# Altium schematic sheet EVK-IRIS-W1_MikroBuses.SchDoc: Top Level Design
size A3; CompanyName: Rigado, LLC; Organization: Rigado; DocumentNumber: 10; SheetNumber: 10; SheetTotal: 14; Website: www.rigado.com; SheetSize: B
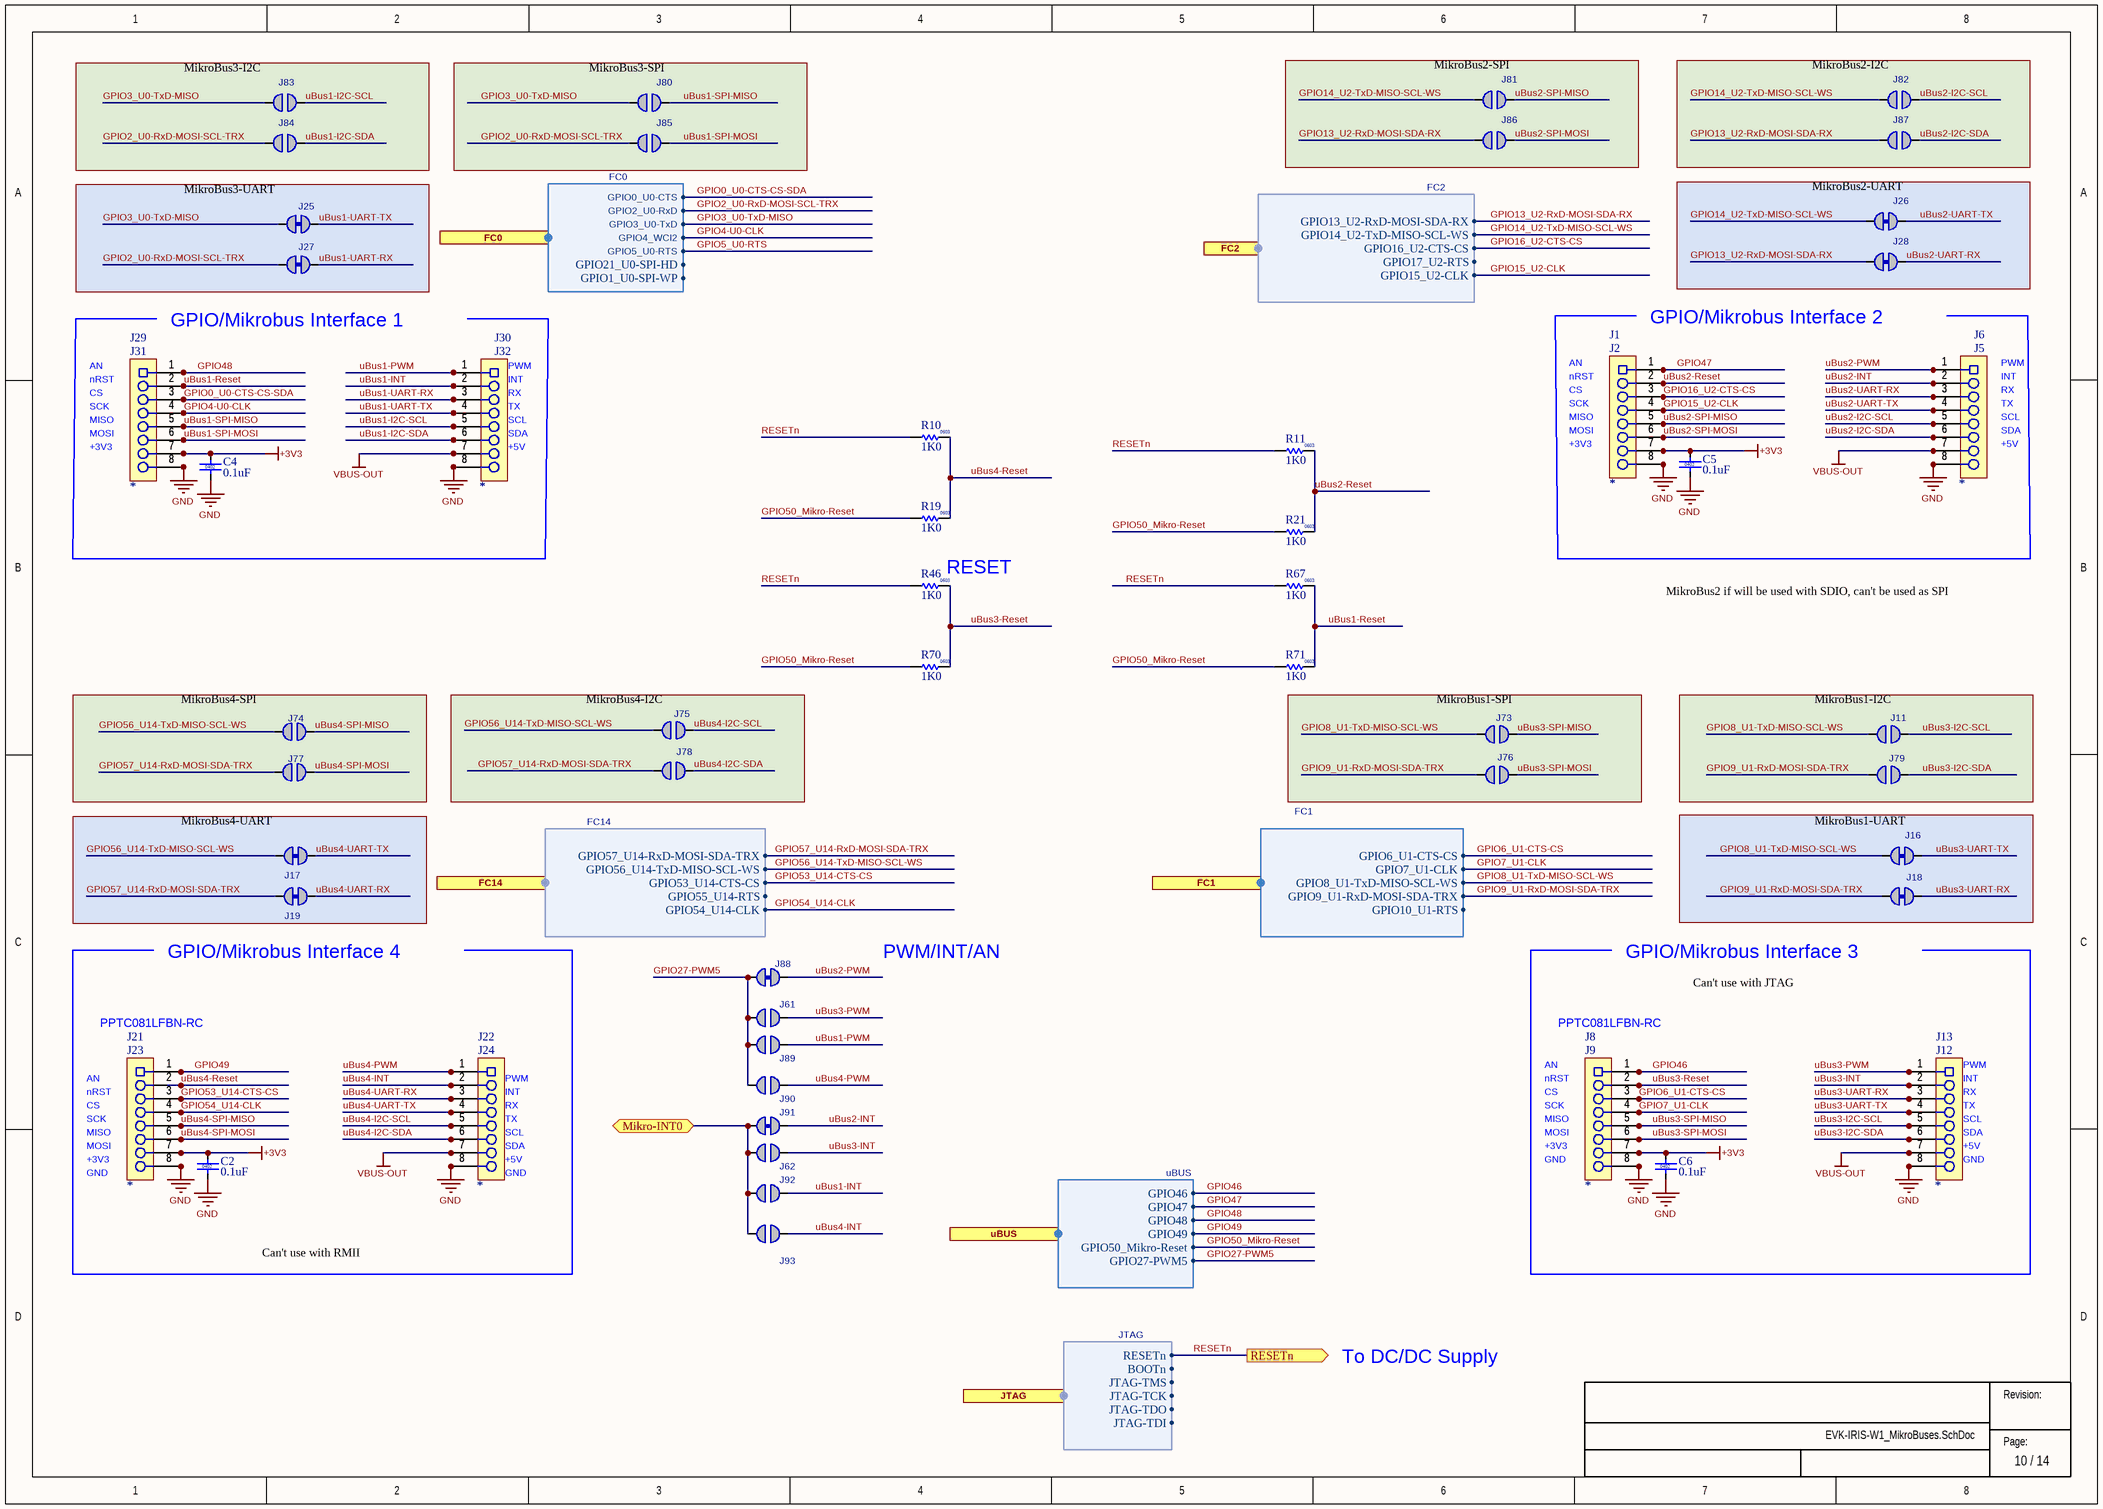
[diagram p0: EVK-IRIS-W1_MikroBuses.SchDoc]

## Parts
C2  value 0.1uF  Size: 0402  [Cap 0402 HD]
C4  value 0.1uF  Size: 0402  [Cap 0402 HD]
C5  value 0.1uF  Size: 0402  [Cap 0402 HD]
C6  value 0.1uF  Size: 0402  [Cap 0402 HD]
J1  (no value)  [SKT-0.1P-8PIN-8x1_TH]
J2  (no value)  [SKT-0.1P-8PIN-8x1_TH]
J5  (no value)  [SKT-0.1P-8PIN-8x1_TH]
J6  (no value)  [SKT-0.1P-8PIN-8x1_TH]
J8  (no value)  [SKT-0.1P-8PIN-8x1_TH]
J9  (no value)  [SKT-0.1P-8PIN-8x1_TH]
J11  Solderbridge-OpenDNP  [Solderbridge-Open]  (value not drawn)  (no BOM)
J12  (no value)  [SKT-0.1P-8PIN-8x1_TH]
J13  (no value)  [SKT-0.1P-8PIN-8x1_TH]
J16  Solderbridge-ShortDNP  [Solderbridge-Short]  (value not drawn)  (net tie, no BOM)
J17  Solderbridge-ShortDNP  [Solderbridge-Short]  (value not drawn)  (net tie, no BOM)
J18  Solderbridge-ShortDNP  [Solderbridge-Short]  (value not drawn)  (net tie, no BOM)
J19  Solderbridge-ShortDNP  [Solderbridge-Short]  (value not drawn)  (net tie, no BOM)
J21  (no value)  [SKT-0.1P-8PIN-8x1_TH]
J22  (no value)  [SKT-0.1P-8PIN-8x1_TH]
J23  (no value)  [SKT-0.1P-8PIN-8x1_TH]
J24  (no value)  [SKT-0.1P-8PIN-8x1_TH]
J25  Solderbridge-ShortDNP  [Solderbridge-Short]  (value not drawn)  (net tie, no BOM)
J26  Solderbridge-ShortDNP  [Solderbridge-Short]  (value not drawn)  (net tie, no BOM)
J27  Solderbridge-ShortDNP  [Solderbridge-Short]  (value not drawn)  (net tie, no BOM)
J28  Solderbridge-ShortDNP  [Solderbridge-Short]  (value not drawn)  (net tie, no BOM)
J29  (no value)  [SKT-0.1P-8PIN-8x1_TH]
J30  (no value)  [SKT-0.1P-8PIN-8x1_TH]
J31  (no value)  [SKT-0.1P-8PIN-8x1_TH]
J32  (no value)  [SKT-0.1P-8PIN-8x1_TH]
J61  Solderbridge-OpenDNP  [Solderbridge-Open]  (value not drawn)  (no BOM)
J62  Solderbridge-OpenDNP  [Solderbridge-Open]  (value not drawn)  (no BOM)
J73  Solderbridge-OpenDNP  [Solderbridge-Open]  (value not drawn)  (no BOM)
J74  Solderbridge-OpenDNP  [Solderbridge-Open]  (value not drawn)  (no BOM)
J75  Solderbridge-OpenDNP  [Solderbridge-Open]  (value not drawn)  (no BOM)
J76  Solderbridge-OpenDNP  [Solderbridge-Open]  (value not drawn)  (no BOM)
J77  Solderbridge-OpenDNP  [Solderbridge-Open]  (value not drawn)  (no BOM)
J78  Solderbridge-OpenDNP  [Solderbridge-Open]  (value not drawn)  (no BOM)
J79  Solderbridge-OpenDNP  [Solderbridge-Open]  (value not drawn)  (no BOM)
J80  Solderbridge-OpenDNP  [Solderbridge-Open]  (value not drawn)  (no BOM)
J81  Solderbridge-OpenDNP  [Solderbridge-Open]  (value not drawn)  (no BOM)
J82  Solderbridge-OpenDNP  [Solderbridge-Open]  (value not drawn)  (no BOM)
J83  Solderbridge-OpenDNP  [Solderbridge-Open]  (value not drawn)  (no BOM)
J84  Solderbridge-OpenDNP  [Solderbridge-Open]  (value not drawn)  (no BOM)
J85  Solderbridge-OpenDNP  [Solderbridge-Open]  (value not drawn)  (no BOM)
J86  Solderbridge-OpenDNP  [Solderbridge-Open]  (value not drawn)  (no BOM)
J87  Solderbridge-OpenDNP  [Solderbridge-Open]  (value not drawn)  (no BOM)
J88  Solderbridge-ShortDNP  [Solderbridge-Short]  (value not drawn)  (net tie, no BOM)
J89  Solderbridge-OpenDNP  [Solderbridge-Open]  (value not drawn)  (no BOM)
J90  Solderbridge-OpenDNP  [Solderbridge-Open]  (value not drawn)  (no BOM)
J91  Solderbridge-ShortDNP  [Solderbridge-Short]  (value not drawn)  (net tie, no BOM)
J92  Solderbridge-OpenDNP  [Solderbridge-Open]  (value not drawn)  (no BOM)
J93  Solderbridge-OpenDNP  [Solderbridge-Open]  (value not drawn)  (no BOM)
R10  value 1K0  Size: 0603  [RES 0603 HD]
R11  value 1K0  Size: 0603  [RES 0603 HD]
R19  value 1K0  Size: 0603  [RES 0603 HD]
R21  value 1K0  Size: 0603  [RES 0603 HD]
R46  value 1K0  Size: 0603  [RES 0603 HD]
R67  value 1K0  Size: 0603  [RES 0603 HD]
R70  value 1K0  Size: 0603  [RES 0603 HD]
R71  value 1K0  Size: 0603  [RES 0603 HD]

## Blocks framed on the sheet
MikroBus3-I2C: J83 J84
MikroBus3-SPI: J80 J85
MikroBus2-SPI: J81 J86
MikroBus2-I2C: J82 J87
MikroBus3-UART: J25 J27
MikroBus2-UART: J26 J28
MikroBus4-SPI: J74 J77
MikroBus4-I2C: J75 J78
MikroBus1-SPI: J73 J76
MikroBus1-I2C: J11 J79
MikroBus4-UART: J17 J19
MikroBus1-UART: J16 J18

## Ports
FC0 (harness FC0), FC1 (harness FC1), FC2 (harness FC2), FC14 (harness FC14), JTAG (harness JTAG), Mikro-INT0 (bidir), RESETn (out), uBUS (harness uBUS)

## Harnesses
FC0: GPIO0_U0-CTS, GPIO2_U0-RxD, GPIO3_U0-TxD, GPIO5_U0-RTS, GPIO4_WCI2, GPIO21_U0-SPI-HD, GPIO1_U0-SPI-WP
uBUS: GPIO46, GPIO47, GPIO48, GPIO49, GPIO50_Mikro-Reset, GPIO27-PWM5
FC2: GPIO13_U2-RxD-MOSI-SDA-RX, GPIO14_U2-TxD-MISO-SCL-WS, GPIO16_U2-CTS-CS, GPIO17_U2-RTS, GPIO15_U2-CLK
FC1: GPIO6_U1-CTS-CS, GPIO7_U1-CLK, GPIO8_U1-TxD-MISO-SCL-WS, GPIO9_U1-RxD-MOSI-SDA-TRX, GPIO10_U1-RTS
FC14: GPIO57_U14-RxD-MOSI-SDA-TRX, GPIO56_U14-TxD-MISO-SCL-WS, GPIO53_U14-CTS-CS, GPIO55_U14-RTS, GPIO54_U14-CLK
JTAG: JTAG-TCK, JTAG-TDI, JTAG-TDO, JTAG-TMS, BOOTn, RESETn

## Nets
+3V3: C2.2 C4.2 C5.2 C6.2 J1.7 J2.7 J8.7 J9.7 J21.7 J23.7 J29.7 J31.7
GND: C2.1 C4.1 C5.1 C6.1 J1.8 J2.8 J5.8 J6.8 J8.8 J9.8 J12.8 J13.8 J21.8 J22.8 J23.8 J24.8 J29.8 J30.8 J31.8 J32.8
VBUS-OUT: J5.7 J6.7 J12.7 J13.7 J22.7 J24.7 J30.7 J32.7
GPIO0_U0-CTS-CS-SDA: J29.3 J31.3 ; port FC0.GPIO0_U0-CTS
GPIO2_U0-RxD-MOSI-SCL-TRX: J27.1 J84.1 J85.1 ; port FC0.GPIO2_U0-RxD
GPIO3_U0-TxD-MISO: J25.1 J80.1 J83.1 ; port FC0.GPIO3_U0-TxD
GPIO4-U0-CLK: J29.4 J31.4 ; port FC0.GPIO4_WCI2
GPIO6_U1-CTS-CS: J8.3 J9.3 ; port FC1.GPIO6_U1-CTS-CS
GPIO7_U1-CLK: J8.4 J9.4 ; port FC1.GPIO7_U1-CLK
GPIO8_U1-TxD-MISO-SCL-WS: J11.1 J16.1 J73.1 ; port FC1.GPIO8_U1-TxD-MISO-SCL-WS
GPIO9_U1-RxD-MOSI-SDA-TRX: J18.1 J76.1 J79.1 ; port FC1.GPIO9_U1-RxD-MOSI-SDA-TRX
GPIO13_U2-RxD-MOSI-SDA-RX: J28.1 J86.1 J87.1 ; port FC2.GPIO13_U2-RxD-MOSI-SDA-RX
GPIO14_U2-TxD-MISO-SCL-WS: J26.1 J81.1 J82.1 ; port FC2.GPIO14_U2-TxD-MISO-SCL-WS
GPIO15_U2-CLK: J1.4 J2.4 ; port FC2.GPIO15_U2-CLK
GPIO16_U2-CTS-CS: J1.3 J2.3 ; port FC2.GPIO16_U2-CTS-CS
GPIO27-PWM5: J61.1 J88.1 J89.1 J90.1 ; port uBUS.GPIO27-PWM5
GPIO46: J8.1 J9.1 ; port uBUS.GPIO46
GPIO47: J1.1 J2.1 ; port uBUS.GPIO47
GPIO48: J29.1 J31.1 ; port uBUS.GPIO48
GPIO49: J21.1 J23.1 ; port uBUS.GPIO49
GPIO50_Mikro-Reset: R19.1 R21.1 R70.1 R71.1 ; port uBUS.GPIO50_Mikro-Reset
GPIO53_U14-CTS-CS: J21.3 J23.3 ; port FC14.GPIO53_U14-CTS-CS
GPIO54_U14-CLK: J21.4 J23.4 ; port FC14.GPIO54_U14-CLK
GPIO56_U14-TxD-MISO-SCL-WS: J17.1 J74.1 J75.1 ; port FC14.GPIO56_U14-TxD-MISO-SCL-WS
GPIO57_U14-RxD-MOSI-SDA-TRX: J19.1 J77.1 J78.1 ; port FC14.GPIO57_U14-RxD-MOSI-SDA-TRX
Mikro-INT0: J62.1 J91.1 J92.1 J93.1 ; port Mikro-INT0
RESETn: R10.1 R11.1 R46.1 R67.1 ; port RESETn, port JTAG.RESETn
uBus1-I2C-SCL: J30.5 J32.5 J83.2
uBus1-I2C-SDA: J30.6 J32.6 J84.2
uBus1-INT: J30.2 J32.2 J92.2
uBus1-PWM: J30.1 J32.1 J89.2
uBus1-Reset: J29.2 J31.2 R67.2 R71.2
uBus1-SPI-MISO: J29.5 J31.5 J80.2
uBus1-SPI-MOSI: J29.6 J31.6 J85.2
uBus1-UART-RX: J27.2 J30.3 J32.3
uBus1-UART-TX: J25.2 J30.4 J32.4
uBus2-I2C-SCL: J5.5 J6.5 J82.2
uBus2-I2C-SDA: J5.6 J6.6 J87.2
uBus2-INT: J5.2 J6.2 J91.2
uBus2-PWM: J5.1 J6.1 J88.2
uBus2-Reset: J1.2 J2.2 R11.2 R21.2
uBus2-SPI-MISO: J1.5 J2.5 J81.2
uBus2-SPI-MOSI: J1.6 J2.6 J86.2
uBus2-UART-RX: J5.3 J6.3 J28.2
uBus2-UART-TX: J5.4 J6.4 J26.2
uBus3-I2C-SCL: J11.2 J12.5 J13.5
uBus3-I2C-SDA: J12.6 J13.6 J79.2
uBus3-INT: J12.2 J13.2 J62.2
uBus3-PWM: J12.1 J13.1 J61.2
uBus3-Reset: J8.2 J9.2 R46.2 R70.2
uBus3-SPI-MISO: J8.5 J9.5 J73.2
uBus3-SPI-MOSI: J8.6 J9.6 J76.2
uBus3-UART-RX: J12.3 J13.3 J18.2
uBus3-UART-TX: J12.4 J13.4 J16.2
uBus4-I2C-SCL: J22.5 J24.5 J75.2
uBus4-I2C-SDA: J22.6 J24.6 J78.2
uBus4-INT: J22.2 J24.2 J93.2
uBus4-PWM: J22.1 J24.1 J90.2
uBus4-Reset: J21.2 J23.2 R10.2 R19.2
uBus4-SPI-MISO: J21.5 J23.5 J74.2
uBus4-SPI-MOSI: J21.6 J23.6 J77.2
uBus4-UART-RX: J19.2 J22.3 J24.3
uBus4-UART-TX: J17.2 J22.4 J24.4

## Notes on the sheet
- AN
- nRST
- GPIO/Mikrobus Interface 1
- PWM
- INT
- GPIO/Mikrobus Interface 2
- CS
- SCK
- MISO
- MOSI
- +3V3
- RX
- TX
- SCL
- SDA
- +5V
- (near R46) RESET
- MikroBus2 if will be used with SDIO, can't be used as SPI
- (near J19) GPIO/Mikrobus Interface 4
- PWM/INT/AN
- (near J18) GPIO/Mikrobus Interface 3
- Can't use with JTAG
- PPTC081LFBN-RC
- GND
- Can't use with RMII
- To DC/DC Supply
- Revision:
- Page:

## Library data of the parts
C2 C4-C6 = 120-00016: Cap, Ceramic 0.1uF 10V 10% X5R 0402; Part Name: CAP CER 0.1UF 10V 10% X5R 0402; Manufacturer 1: Murata Electronics North America; Manufacturer Part Number 1: GRM155R61A104KA01J; Tolerance: +/- 10%; Use in new designs: Yes; Item Phase: In Production; UBX Code: None; Part Number: 120-00016; Revision: 0A; Manufacturer 2: Yageo; Height: 0.55mm; Pins: 2; Temperature Coefficient: X5R; Voltage: 10V; Max Operating Temp: 85; Min Operating Temp: -55; Supplier 1: Digi-Key; Supplier Part Number 1: 490-6297-1-ND; Manufacturer Part Number 2: CC0402KRX5R6BB104; Supplier 2: Digi-Key; Supplier Part Number 2: 311-1336-1-ND
J1 J2 J5 J6 J8 J9 J12 J13 J21-J24 J29-J32 = PPTC081LFBN-RC: Socket, 0.100" Pitch, 8 Pin, Vert TH, Black; Manufacturer 1: Samtec Inc.; Part Name: CON HDR 0.1" 8 Pin 1 Row TH Vert; Item Phase: In Production; Use in new designs: Yes; Voltage: None; Part Number: PPTC081LFBN-RC; Manufacturer Part Number 1: PPTC081LFBN-RC; Supplier 1: None; Supplier Part Number 1: None; Diameter: None; Max Operating Temp: None; Min Operating Temp: None; Pins: 8; Revision: 0A; UBX Code: None; Manufacturer 2: None; Manufacturer Part Number 2: None; Supplier 2: None; Supplier Part Number 2: None; Manufacturer P/N: *
J11 J61 J62 J73-J87 J89 J90 J92 J93 = Solderbridge-Open: Added By: Paul B; Part Number: Solderbridge-Open; Height: 0; DNP: DNP; Added Date: 12/2/2015
J16-J19 J25-J28 J88 J91 = Solderbridge-Short: Added By: Paul B; Part Number: Solderbridge-Short; Height: 0; DNP: DNP; Added Date: 12/2/2015
R10 R11 R19 R21 R46 R67 R70 R71 = UBXH18-0000400: RES THICK FILM CHIP 0603 25PPM 1K0 0.1% 100mW; Manufacturer: YAGEO; Manufacturer P/N: RT0603BRD071KL; Editor: martin.kessel; Env: ROHS; Permitted Use: Internal Use; Perferred: PREF; Mfg P/N Status: Active; Mfg P/N Split: 100; Mfg P/N Released: No; Part Number: UBXH18-0000400; Tolerance: 0.1%; Max Power: 100mW; Part Type: Resistor; UBX Wiki: https://wiki.u-blox.com/bin/view/Operations/PartDetails?index=27323; RefDes: R; Min Operating Temp: -55°C; Max Operating Temp: 155°C